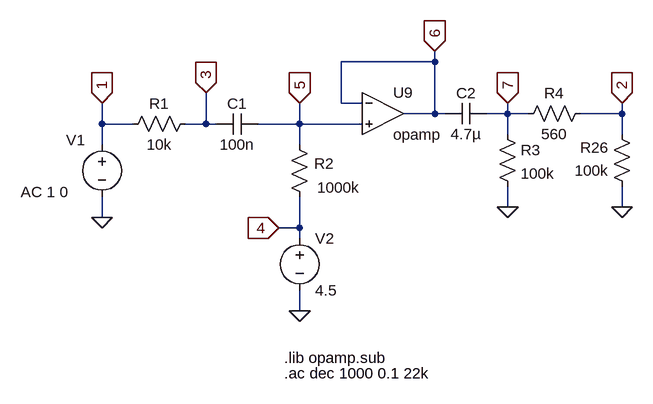
[diagram p0: schematic Klon-Centaur_bypass-OLD.asc]
Klon-Centaur_bypass-OLD.asc, the LTspice schematic file:
Version 4
SHEET 1 4496 5064
WIRE -272 2480 -272 2464
WIRE -272 2480 -416 2480
WIRE -416 2544 -416 2480
WIRE -384 2544 -416 2544
WIRE -272 2560 -272 2480
WIRE -272 2560 -320 2560
WIRE -256 2560 -272 2560
WIRE -160 2560 -160 2544
WIRE -160 2560 -192 2560
WIRE -128 2560 -160 2560
WIRE 16 2560 16 2544
WIRE 16 2560 -48 2560
WIRE -784 2576 -784 2544
WIRE -736 2576 -784 2576
WIRE -624 2576 -624 2528
WIRE -624 2576 -656 2576
WIRE -608 2576 -624 2576
WIRE -480 2576 -480 2544
WIRE -480 2576 -544 2576
WIRE -384 2576 -480 2576
WIRE -160 2592 -160 2560
WIRE 16 2592 16 2560
WIRE -784 2608 -784 2576
WIRE -480 2608 -480 2576
WIRE -160 2704 -160 2672
WIRE 16 2704 16 2672
WIRE -784 2720 -784 2688
WIRE -480 2736 -480 2688
WIRE -480 2736 -512 2736
WIRE -480 2752 -480 2736
WIRE -480 2864 -480 2832
FLAG -784 2544 1
IOPIN -784 2544 In
FLAG -480 2864 0
FLAG -784 2720 0
FLAG -160 2704 0
FLAG 16 2704 0
FLAG -624 2528 3
IOPIN -624 2528 In
FLAG -480 2544 5
IOPIN -480 2544 In
FLAG -160 2544 7
IOPIN -160 2544 In
FLAG 16 2544 2
IOPIN 16 2544 In
FLAG -512 2736 4
IOPIN -512 2736 In
FLAG -272 2464 6
IOPIN -272 2464 In
SYMBOL voltage -784 2592 R0
WINDOW 0 -55 9 Left 2
WINDOW 123 -125 89 Left 2
WINDOW 39 0 0 Left 0
WINDOW 3 -289 58 Left 2
SYMATTR InstName V1
SYMATTR Value2 AC 1 0
SYMATTR Value ""
SYMBOL res -640 2560 R90
WINDOW 0 0 56 VBottom 2
WINDOW 3 32 56 VTop 2
SYMATTR InstName R1
SYMATTR Value 10k
SYMBOL res -464 2704 R180
WINDOW 0 -37 67 Left 2
WINDOW 3 -77 30 Left 2
SYMATTR InstName R2
SYMATTR Value 1000k
SYMBOL cap -544 2560 R90
WINDOW 0 0 32 VBottom 2
WINDOW 3 32 32 VTop 2
SYMATTR InstName C1
SYMATTR Value 100n
SYMBOL voltage -480 2736 R0
WINDOW 123 0 0 Left 0
WINDOW 39 0 0 Left 0
SYMATTR InstName V2
SYMATTR Value 4.5
SYMBOL OpAmps\\opamp -352 2496 R0
SYMATTR InstName U9
SYMBOL cap -192 2544 R90
WINDOW 0 0 32 VBottom 2
WINDOW 3 32 32 VTop 2
SYMATTR InstName C2
SYMATTR Value 4.7µ
SYMBOL res -176 2576 R0
SYMATTR InstName R3
SYMATTR Value 100k
SYMBOL res -32 2544 R90
WINDOW 0 0 56 VBottom 2
WINDOW 3 32 56 VTop 2
SYMATTR InstName R4
SYMATTR Value 560
SYMBOL res 32 2688 R180
WINDOW 0 36 76 Left 2
WINDOW 3 36 40 Left 2
SYMATTR InstName R26
SYMATTR Value 100k
TEXT -504 2936 Left 2 !.lib opamp.sub
TEXT -504 2960 Left 2 !.ac dec 1000 0.1 22k

The netlist it stands for:
* Klon-Centaur_bypass-OLD.asc
V1 1 0 AC 1 0
R1 3 1 10k
R2 4 5 1000k
C1 5 3 100n
V2 4 0 4.5
XU9 6 5 6 opamp Aol=100K GBW=10Meg  ; pins invin noninvin out
C2 7 6 4.7µ
R3 7 0 100k
R4 2 7 560
R26 0 2 100k
.lib opamp.sub
.ac dec 1000 0.1 22k
.backanno
.end